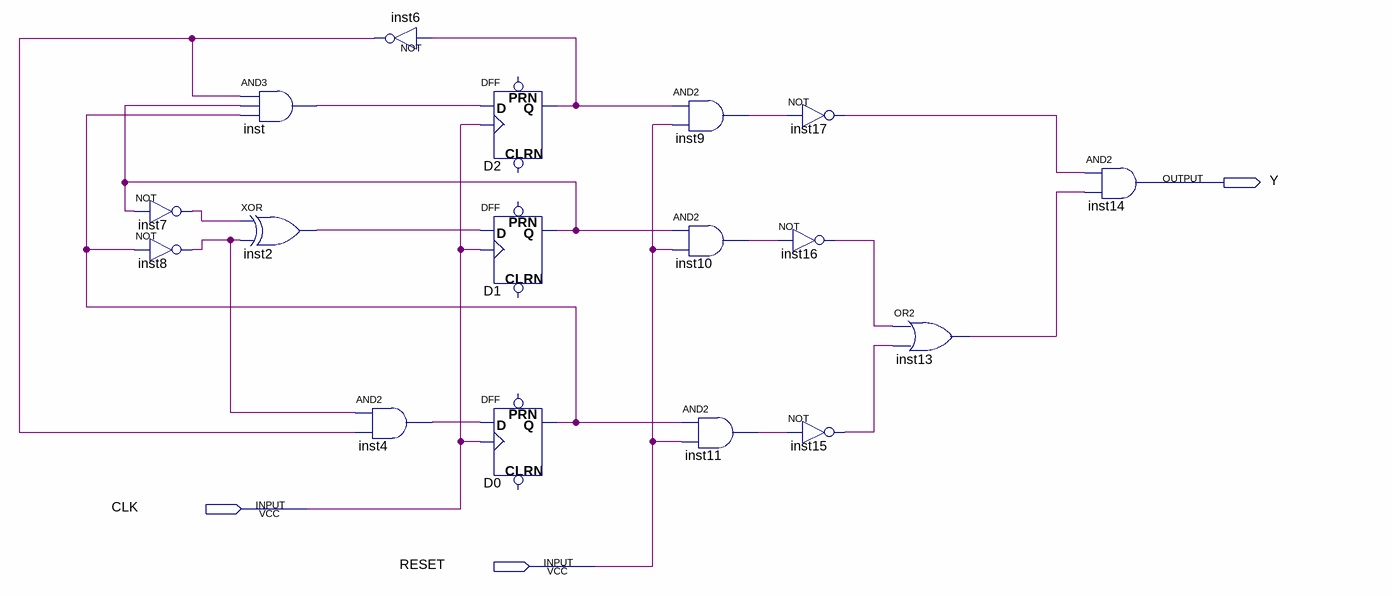
[diagram p0: schematic sheet]
// Quartus schematic MEF.bdf as structural Verilog: 17 symbols, 3 pins
module MEF (
  input  CLK,
  input  RESET,
  output Y
);

  wire D0_q, D1_q, D2_q, inst2_out, inst4_out, inst6_out, inst7_out, inst8_out, inst9_out, inst10_out,
       inst11_out, inst13_out, inst15_out, inst16_out, inst17_out, inst_out;

  not inst7 (inst7_out, D1_q);
  not inst8 (inst8_out, D0_q);
  and inst (inst_out, inst6_out, D1_q, D0_q);
  xor inst2 (inst2_out, inst7_out, inst8_out);
  not inst6 (inst6_out, D2_q);
  and inst4 (inst4_out, inst8_out, inst6_out);
  DFF D2 (.CLK(CLK), .D(inst_out), .Q(D2_q));  // open: CLRN, PRN
  DFF D1 (.CLK(CLK), .D(inst2_out), .Q(D1_q));  // open: CLRN, PRN
  DFF D0 (.CLK(CLK), .D(inst4_out), .Q(D0_q));  // open: CLRN, PRN
  and inst9 (inst9_out, D2_q, RESET);
  and inst10 (inst10_out, D1_q, RESET);
  and inst11 (inst11_out, D0_q, RESET);
  not inst17 (inst17_out, inst9_out);
  not inst16 (inst16_out, inst10_out);
  not inst15 (inst15_out, inst11_out);
  or inst13 (inst13_out, inst16_out, inst15_out);
  and inst14 (Y, inst17_out, inst13_out);
endmodule
